# EAGLE schematic brakelight_V3 (EAGLE 9.5.2)
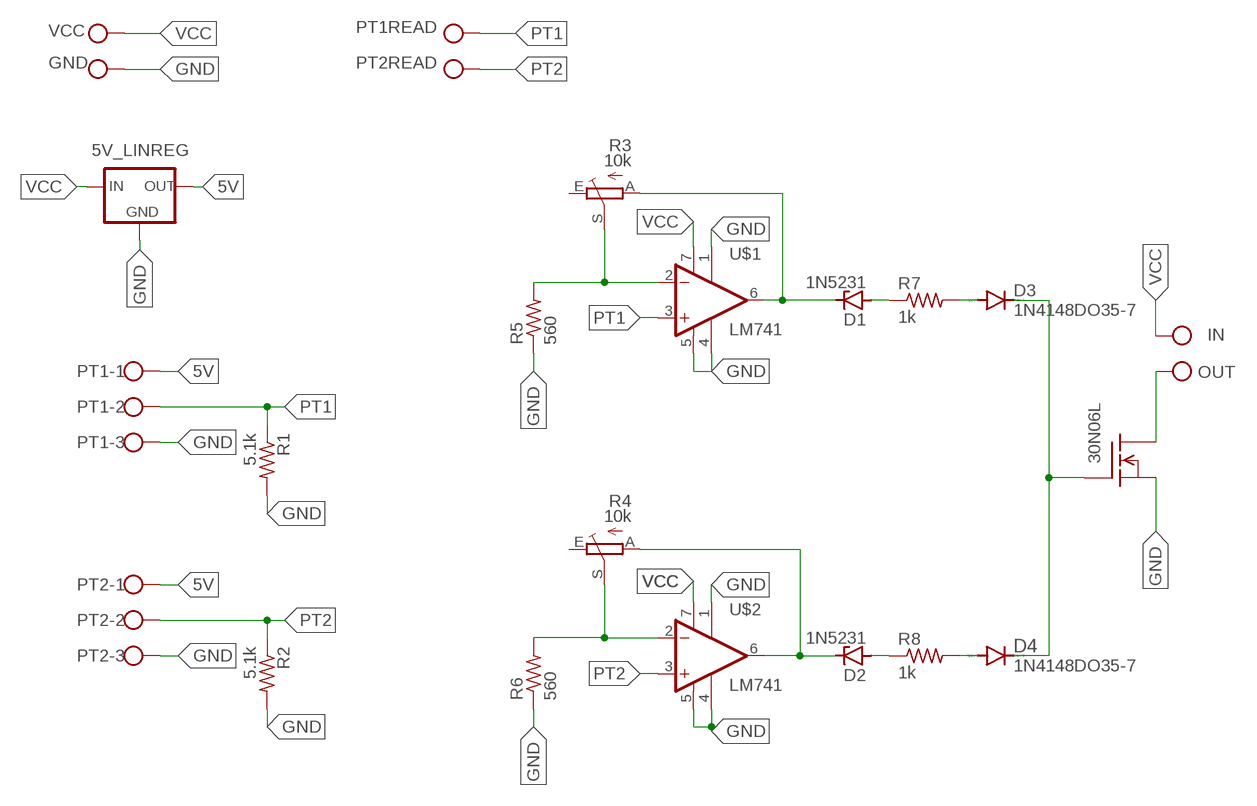
[diagram p0: schematic, sheet 1]

## Parts
5V_LINREG  78XXL  [78XXL]
BRAKELIGHT  W237-102  [W237-102]
D1  1N5231  ZENER-DIODEDO34-7  [DO34Z7]
D2  1N5231  ZENER-DIODEDO34-7  [DO34Z7]
D3  1N4148DO35-7  [DO35-7]
D4  1N4148DO35-7  [DO35-7]
INO_READ  W237-102  [W237-102]
LIPO_CONN  W237-102  [W237-102]
PT1  W237-103  [W237-103]
PT2  W237-103  [W237-103]
Q2  30N06L  SUP75N06-08  [TO220]
R1  5.1k  R-US_0207/5V  [0207/5V]
R2  5.1k  R-US_0207/5V  [0207/5V]
R3  10k  TRIM_EU-RS3  [RS3]
R4  10k  TRIM_EU-RS3  [RS3]
R5  560  R-US_0207/5V  [0207/5V]
R6  560  R-US_0207/5V  [0207/5V]
R7  1k  R-US_0204/5  [0204/5]
R8  1k  R-US_0204/5  [0204/5]
U$1  LM741  [DIL08]
U$2  LM741  [DIL08]

## Nets
5V: 5V_LINREG.OUT PT1.1 PT2.1
GND: 5V_LINREG.GND LIPO_CONN.2 PT1.3 PT2.3 Q2.3(S) R1.2 R2.2 R5.1 R6.1 U$1.1(OFFSETNULL) U$1.4(V-) U$1.5(OFFSETNULL2) U$2.1(OFFSETNULL) U$2.4(V-) U$2.5(OFFSETNULL2)
N$1: D2.C R4.A U$2.6(OUT)
N$2: BRAKELIGHT.2 Q2.2(D)
N$3: D3.A R7.2
N$4: D4.A R8.2
N$5: D1.A R7.1
N$6: D2.A R8.1
N$7: D3.C D4.C Q2.1(G)
N$8: D1.C R3.A U$1.6(OUT)
PT1: INO_READ.1 PT1.2 R1.1 U$1.3(NONINV_INPUT)
PT2: INO_READ.2 PT2.2 R2.1 U$2.3(NONINV_INPUT)
THRESH1: R3.S R5.2 U$1.2(INV_INPUT)
THRESH2: R4.S R6.2 U$2.2(INV_INPUT)
VCC: 5V_LINREG.IN BRAKELIGHT.1 LIPO_CONN.1 U$1.7(V+) U$2.7(V+)
Unconnected: R3.E R4.E

## Library data of the parts
5V_LINREG = v-reg:78XXL: VOLTAGE REGULATOR
BRAKELIGHT INO_READ LIPO_CONN = con-wago-500:W237-102: WAGO SCREW CLAMP; MPN: 237-102; OC_FARNELL: unknown; OC_NEWARK: 70K9898
D1 D2 = diode:ZENER-DIODE: Z-Diode
D3 D4 = diode:1N4148: DIODE high speed (Philips)
PT1 PT2 = con-wago-500:W237-103: WAGO SCREW CLAMP; MPN: 237-103; OC_FARNELL: unknown; OC_NEWARK: 18M7116
Q2 = transistor-fet:SUP75N06-08: N-Channel Enhancement MOSFET 60V; 75A; 0,008Ohm; SPICEPREFIX: Q
R1 R2 R5-R8 = 0ohmresistor:R-US_: RESISTOR, American symbol; SPICEPREFIX: R
R3 R4 = pot:TRIM_EU-: POTENTIOMETER
U$1 = GTOR:LM741
U$2 = GTOR:LM741; SPICEPREFIX: X